# EAGLE schematic Weather Shield (EAGLE 7.3.0)
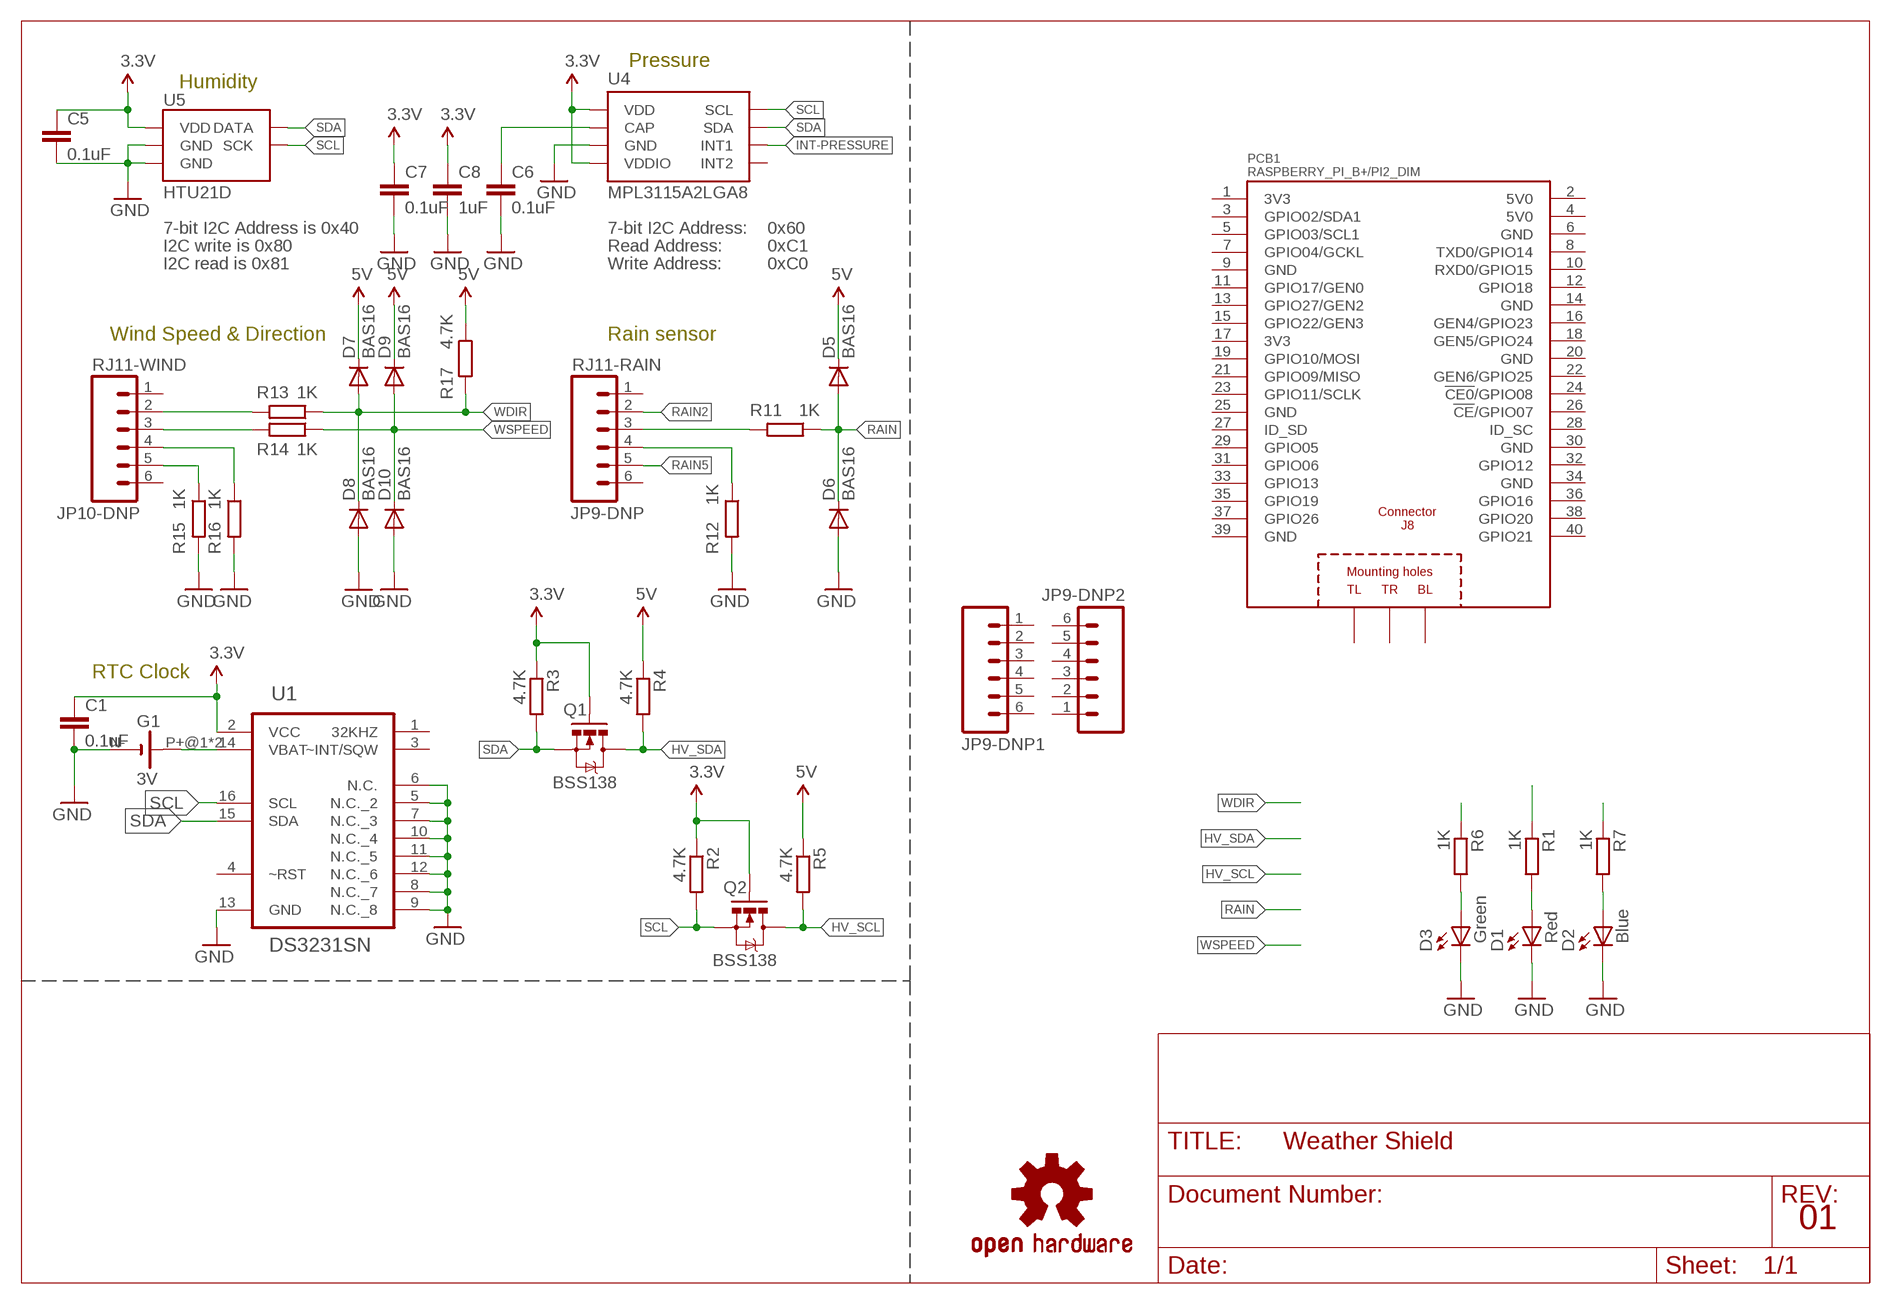
[diagram p0: schematic, sheet 1]

## Parts
C1  0.1uF  CAP0603-CAP  [0603-CAP]
C5  0.1uF  CAP0603-CAP  [0603-CAP]
C6  0.1uF  CAP0603-CAP  [0603-CAP]
C7  0.1uF  CAP0603-CAP  [0603-CAP]
C8  1uF  CAP0603-CAP  [0603-CAP]
D1  Red  LED0603  [LED-0603]
D2  Blue  LED0603  [LED-0603]
D3  Green  LED0603  [LED-0603]
D5  BAS16  DIODESOD  [SOD-323]
D6  BAS16  DIODESOD  [SOD-323]
D7  BAS16  DIODESOD  [SOD-323]
D8  BAS16  DIODESOD  [SOD-323]
D9  BAS16  DIODESOD  [SOD-323]
D10  BAS16  DIODESOD  [SOD-323]
G1  3V  BATTERY-HOLDER_11.6MM  [CELL_RETAINER_11.6MM]
JP9-DNP  RJ11-RAIN  RJ11-6PTH  [RJ11-6]
JP9-DNP1  RJ11-6PTH  [RJ11-6]
JP9-DNP2  RJ11-6PTH  [RJ11-6]
JP10-DNP  RJ11-WIND  RJ11-6PTH  [RJ11-6]
LOGO1  OSHW-LOGOM  [OSHW-LOGO-M]
PCB1  RASPBERRY_PI_B+/PI2_DIM  [RASPBERRY_PI_BPLUS_DIM]
Q1  BSS138  MOSFET-NCHANNELSMD  [SOT23-3]
Q2  BSS138  MOSFET-NCHANNELSMD  [SOT23-3]
R1  1K  R-EU_R0603  [R0603]
R2  4.7K  R-EU_R0603  [R0603]
R3  4.7K  R-EU_R0603  [R0603]
R4  4.7K  R-EU_R0603  [R0603]
R5  4.7K  R-EU_R0603  [R0603]
R6  1K  R-EU_R0603  [R0603]
R7  1K  R-EU_R0603  [R0603]
R11  1K  R-EU_R0603  [R0603]
R12  1K  R-EU_R0603  [R0603]
R13  1K  R-EU_R0603  [R0603]
R14  1K  R-EU_R0603  [R0603]
R15  1K  R-EU_R0603  [R0603]
R16  1K  R-EU_R0603  [R0603]
R17  4.7K  R-EU_R0603  [R0603]
U1  DS3231SN  [SOIC127P1032X265-16N]
U4  MPL3115A2LGA8  [LGA8]
U5  HTU21D  HTU21DSMD  [HTU21D]

## Nets
3.3V: C5.1 C7.1 C8.1 Q1.1(G) Q2.1(G) R2.1 R3.1 U4.1(VDD) U4.4(VDDIO) U5.VDD
5V: D5.1(C) D7.1(C) D9.1(C) R4.1 R5.1 R17.1
GND [vcc]: C1.2 C5.2 C6.2 C7.2 C8.2 D1.C D2.C D3.C D6.2(A) D8.2(A) D10.2(A) G1.N-(-) R12.2 R15.2 R16.2 U1.5(N.C._2) U1.6(N.C.) U1.7(N.C._3) U1.8(N.C._7) U1.9(N.C._8) U1.10(N.C._4) U1.11(N.C._5) U1.12(N.C._6) U1.13(GND) U4.3(GND) U5.7(GND) U5.GND
HV_SCL: Q2.3(D) R5.2
HV_SDA: Q1.3(D) R4.2
INT-PRESSURE: U4.6(INT1)
N$1: JP10-DNP.3 R14.2
N$2: JP10-DNP.2 R13.2
N$3: D1.A R1.2
N$4: JP9-DNP.3 R11.2
N$5: C6.1 U4.2(CAP)
N$6: G1.P+@1(+) G1.P+@2(+) U1.14(VBAT)
N$7: D3.A R6.2
N$10: D2.A R7.2
N$11: JP9-DNP.4 R12.1
N$12: JP10-DNP.5 R15.1
N$13: JP10-DNP.4 R16.1
RAIN: D5.2(A) D6.1(C) R11.1
RAIN2: JP9-DNP.2
RAIN5: JP9-DNP.5
SCL: Q2.2(S) R2.2 U1.16(SCL) U4.8(SCL) U5.SCK
SDA: Q1.2(S) R3.2 U1.15(SDA) U4.7(SDA) U5.DATA
STAT1: R1.1
STAT2: R6.1
STAT3: R7.1
VCC: C1.1 U1.2(VCC) ; supply symbol labelled 3.3V
WDIR: D7.2(A) D8.1(C) R13.1 R17.2
WSPEED: D9.2(A) D10.1(C) R14.1
Unconnected: JP9-DNP1.1 JP9-DNP1.2 JP9-DNP1.3 JP9-DNP1.4 JP9-DNP1.5 JP9-DNP1.6 JP9-DNP2.1 JP9-DNP2.2 JP9-DNP2.3 JP9-DNP2.4 JP9-DNP2.5 JP9-DNP2.6 JP9-DNP.1 JP9-DNP.6 JP10-DNP.1 JP10-DNP.6 PCB1.3(GPIO02/SDA1) PCB1.5(GPIO03/SCL1) PCB1.7(GPIO04/GCKL) PCB1.8(TXD0/GPIO14) PCB1.10(RXD0/GPIO15) PCB1.11(GPIO17/GEN0) PCB1.12(GPIO18) PCB1.13(GPIO27/GEN2) PCB1.15(GPIO22/GEN3) PCB1.16(GEN4/GPIO23) PCB1.18(GEN5/GPIO24) PCB1.19(GPIO10/MOSI) PCB1.21(GPIO09/MISO) PCB1.22(GEN6/GPIO25) PCB1.23(GPIO11/SCLK) PCB1.24(!CE0!/GPIO08) PCB1.26(!CE!/GPIO07) PCB1.27(ID_SD) PCB1.28(ID_SC) PCB1.29(GPIO05) PCB1.31(GPIO06) PCB1.32(GPIO12) PCB1.33(GPIO13) PCB1.35(GPIO19) PCB1.36(GPIO16) PCB1.37(GPIO26) PCB1.38(GPIO20) PCB1.40(GPIO21) PCB1.PE_BL(BL) PCB1.PE_TL(TL) PCB1.PE_TR(TR) U1.1(32KHZ) U1.3(~INT/SQW) U1.4(~RST) U4.5(INT2)

## Notes on the sheet
- Pressure
- Humidity
- 7-bit I2C Address is 0x40 | 7-bit I2C Address: | 0x60
- I2C write is 0x80 | Read Address: | 0xC1
- I2C read is 0x81 | Write Address: | 0xC0
- Wind Speed & Direction | Rain sensor
- RTC Clock
- 01

## Power pins joined to a net without a drawn wire
3V3: PCB1.1(3V3) PCB1.17(3V3)
5V0: PCB1.2(5V0) PCB1.4(5V0)
GND: PCB1.6(GND) PCB1.9(GND) PCB1.14(GND) PCB1.20(GND) PCB1.25(GND) PCB1.30(GND) PCB1.34(GND) PCB1.39(GND)

## Library data of the parts
C1 C5-C8 = SparkFun:CAP: Capacitor Standard 0603 ceramic capacitor, and 0.1" leaded capacitor.
D1-D3 = SparkFun:LED: LEDs Standard schematic elements and footprints for 5mm, 3mm, 1206, and 0603 sized LEDs. 5mm - Spark Fun Electronics SKU : COM-00529 (and others)
D5-D10 = SparkFun:DIODE: Diode These are standard reverse protection diodes and small signal diodes. SMA package can handle up to about 1A. SOD-323 can handle about 200mA. What the SOD-323 package when ordering, there are some mfgs out there that are 5-pin packages.
G1 = battery:BATTERY-HOLDER_11.6MM: 11.6mm PC BUTTON CELL RETAINER, high 5.97mm KEYSTONE ELECTRONICS CORP. Data sheet <http://www.farnell.com/cad/1718310.pdf>; MF: KEYSTONE; MPN: 2997; OC_FARNELL: 2293265
JP9-DNP JP9-DNP1 JP9-DNP2 JP10-DNP = SparkFun:RJ11-6: RJ11 Jack Simple 6 pin RJ11 jack. Commonly found on CAT3 devices and Microchip programmers. SKU: PRT-00132
LOGO1 = SparkFun-Aesthetics:OSHW-LOGO: Open Source Hardware Logo This logo indicates the piece of hardware it is found on incorporates a OSHW license and/or adheres to the definition of open source hardware found here: http://freedomdefined.org/OSHW
PCB1 = FSE_Weather_Shield:RASPBERRY_PI_B+/PI2: Raspberry Pi B+ Basedon issue: Thursday, July 10, 2014 - Rev 1.2 LBR by Tim Rettmann 07-2014
Q1 Q2 = SparkFun:MOSFET-NCHANNEL
R1-R7 R11-R17 = rcl:R-EU_: RESISTOR, European symbol
U1 = FSE_Weather_Shield:DS3231SN: Extremely Accurate I2C-Integrated RTC/TCXO/Crystal; MPN: DS3231SN#; OC_FARNELL: 1593292; OC_NEWARK: 68K3406; PACKAGE: SOIC-16; SUPPLIER: Maxim
U4 = SparkFun-Sensors:MPL3115A2: Altimeter/Pressure Sensor, I2C, 1.95V-3.6V supply, 50 to 110kPa
U5 = SparkFun-Sensors:HTU21D

## Net classes
0 Default: width 0.203 mm
1 vcc: width 0.203 mm